# Altium schematic sheet Top_Level.SchDoc
size C; SheetNumber: 2; SheetTotal: 5
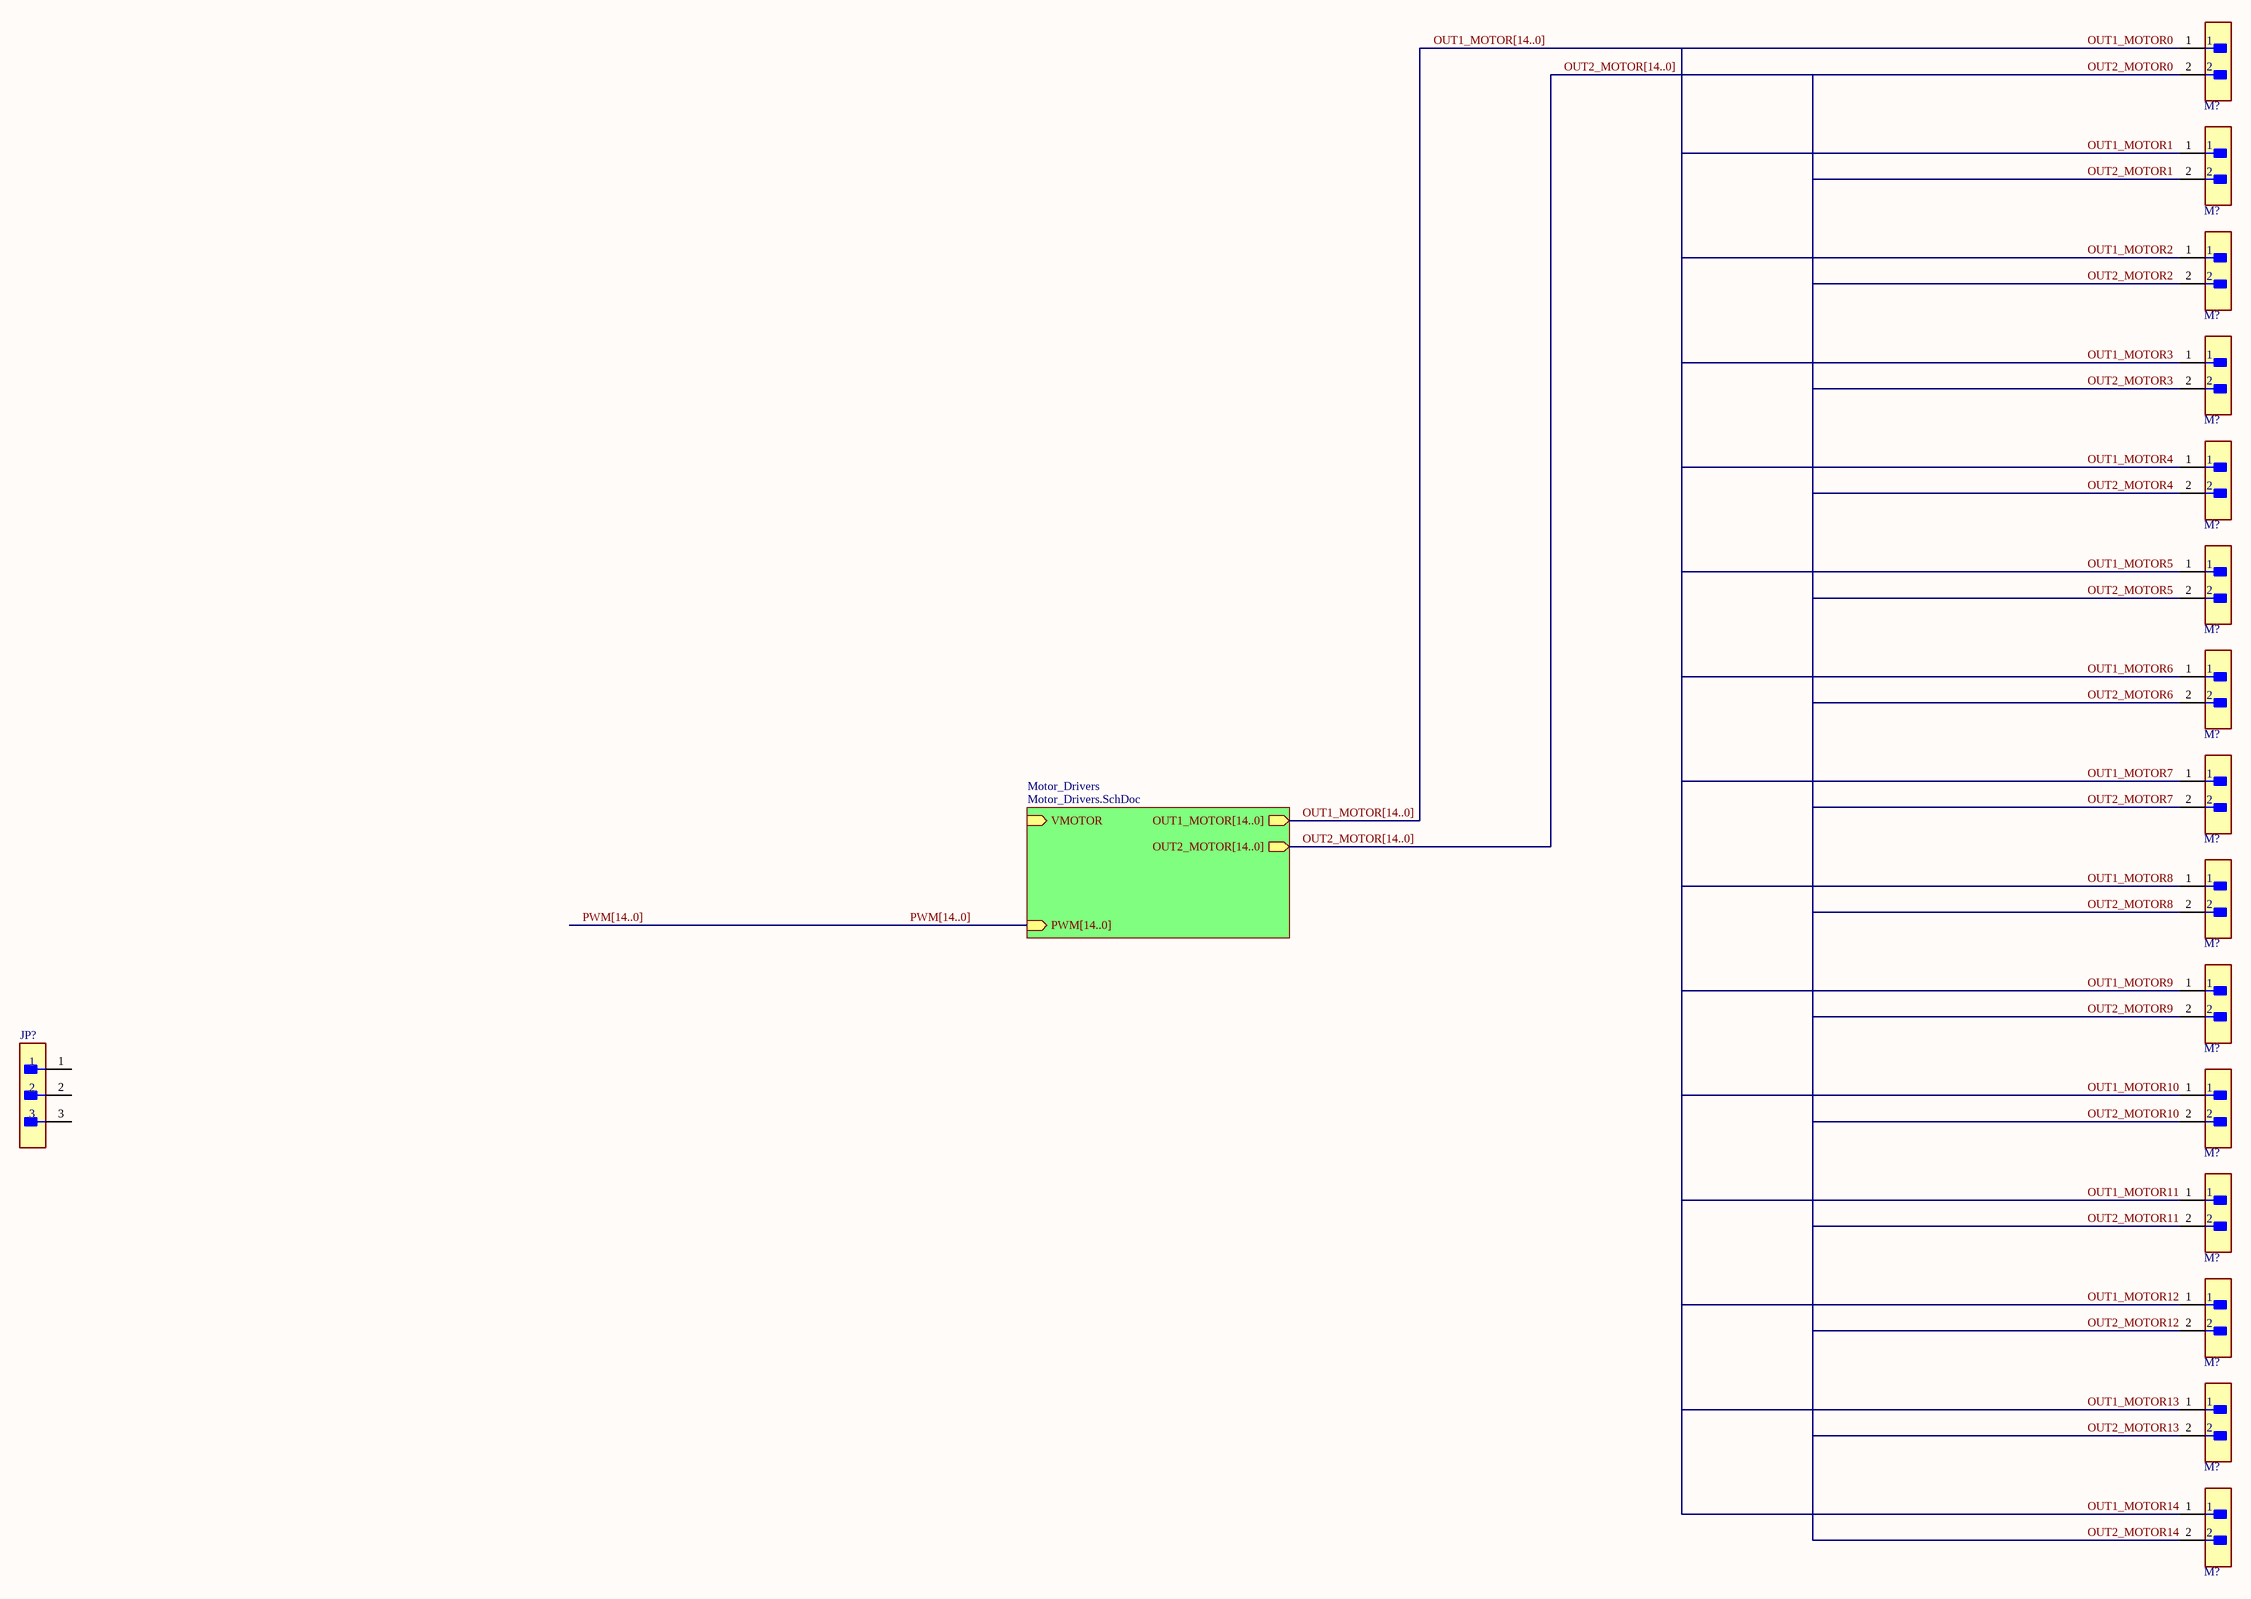
[diagram p0: Top_Level.SchDoc]

## Parts
(Parts that share a designator on the sheet are numbered #1, #2 ... from top to bottom, then left to right.)
JP?  B3B-XH-AM(LF)(SN)  [FP-B3B-XH-AM_LF_SN-MFG]  (value not drawn)
M?#1  B2B-EH-A(LF)(SN)  [FP-B2B-EH-A_LF_SN-MFG]  (value not drawn)
M?#2  B2B-EH-A(LF)(SN)  [FP-B2B-EH-A_LF_SN-MFG]  (value not drawn)
M?#3  B2B-EH-A(LF)(SN)  [FP-B2B-EH-A_LF_SN-MFG]  (value not drawn)
M?#4  B2B-EH-A(LF)(SN)  [FP-B2B-EH-A_LF_SN-MFG]  (value not drawn)
M?#5  B2B-EH-A(LF)(SN)  [FP-B2B-EH-A_LF_SN-MFG]  (value not drawn)
M?#6  B2B-EH-A(LF)(SN)  [FP-B2B-EH-A_LF_SN-MFG]  (value not drawn)
M?#7  B2B-EH-A(LF)(SN)  [FP-B2B-EH-A_LF_SN-MFG]  (value not drawn)
M?#8  B2B-EH-A(LF)(SN)  [FP-B2B-EH-A_LF_SN-MFG]  (value not drawn)
M?#9  B2B-EH-A(LF)(SN)  [FP-B2B-EH-A_LF_SN-MFG]  (value not drawn)
M?#10  B2B-EH-A(LF)(SN)  [FP-B2B-EH-A_LF_SN-MFG]  (value not drawn)
M?#11  B2B-EH-A(LF)(SN)  [FP-B2B-EH-A_LF_SN-MFG]  (value not drawn)
M?#12  B2B-EH-A(LF)(SN)  [FP-B2B-EH-A_LF_SN-MFG]  (value not drawn)
M?#13  B2B-EH-A(LF)(SN)  [FP-B2B-EH-A_LF_SN-MFG]  (value not drawn)
M?#14  B2B-EH-A(LF)(SN)  [FP-B2B-EH-A_LF_SN-MFG]  (value not drawn)
M?#15  B2B-EH-A(LF)(SN)  [FP-B2B-EH-A_LF_SN-MFG]  (value not drawn)

## Sub-sheets
Motor_Drivers = Motor_Drivers.SchDoc: VMOTOR (in), PWM[14..0] (in), OUT1_MOTOR[14..0] (out), OUT2_MOTOR[14..0] (out)

## Nets
OUT1_MOTOR0: M?#1.1
OUT1_MOTOR1: M?#2.1
OUT1_MOTOR2: M?#3.1
OUT1_MOTOR3: M?#4.1
OUT1_MOTOR4: M?#5.1
OUT1_MOTOR5: M?#6.1
OUT1_MOTOR6: M?#7.1
OUT1_MOTOR7: M?#8.1
OUT1_MOTOR8: M?#9.1
OUT1_MOTOR9: M?#10.1
OUT1_MOTOR10: M?#11.1
OUT1_MOTOR11: M?#12.1
OUT1_MOTOR12: M?#13.1
OUT1_MOTOR13: M?#14.1
OUT1_MOTOR14: M?#15.1
OUT2_MOTOR0: M?#1.2
OUT2_MOTOR1: M?#2.2
OUT2_MOTOR2: M?#3.2
OUT2_MOTOR3: M?#4.2
OUT2_MOTOR4: M?#5.2
OUT2_MOTOR5: M?#6.2
OUT2_MOTOR6: M?#7.2
OUT2_MOTOR7: M?#8.2
OUT2_MOTOR8: M?#9.2
OUT2_MOTOR9: M?#10.2
OUT2_MOTOR10: M?#11.2
OUT2_MOTOR11: M?#12.2
OUT2_MOTOR12: M?#13.2
OUT2_MOTOR13: M?#14.2
OUT2_MOTOR14: M?#15.2

Not connected (* = marked no-connect by the designer): JP? 1 2 3

## Buses and harness runs
bus OUT1_MOTOR[14..0] = sheet Motor_Drivers/OUT1_MOTOR[14..0]
bus OUT2_MOTOR[14..0] = sheet Motor_Drivers/OUT2_MOTOR[14..0]
bus PWM[14..0] = sheet Motor_Drivers/PWM[14..0]

## Library data of the parts
JP? = CMP-17438-000009-1: CONN HEADER VERT 3POS 2.5MM; Max Current Rating: 3A; Gender: Male; Max Voltage Rating (AC): 250V; Connector Type: Male Pin; Pitch: 0.098inch; Number of Positions: 3; Contact Resistance: 20mR; Termination: Press-Fit; Housing Color: White; Housing Material: Polyamide; Orientation: Straight; Contact Material: Brass; Contact Type: Male Pin; Color: Natural; Packaging: Bulk; Lead Free: Lead Free; Depth: 5.75mm; Number of Rows: 1; Contact Plating: Tin; Length: 9.9mm; Max Operating Temperature: 85°C; Series: XH; Min Operating Temperature: -25°C; Fastening Type: Detent; Mount: Through Hole
M?#1-M?#15 = CMP-17439-000026-1: CONN HEADER VERT 2POS 2.5MM; Number of Contacts: 2; Current Rating: 3A; Connector Type: Plug; Contact Resistance: 20mR; Gender: Male; Voltage Rating: 250V; Fastening Type: Detent; Depth: 3.8mm; Max Operating Temperature: 85°C; Orientation: Straight; Series: EH; Contact Plating: Tin; Min Operating Temperature: -25°C; Contact Type: Male Pin; Housing Color: White; Termination: Press-Fit; Housing Material: Nylon; Pitch: 2.5mm; Number of Positions: 2; Max Current Rating: 3A; Packaging: Bulk; Lead Free: Lead Free; Number of Rows: 1; Length: 7.5mm; Contact Mating Length: 0.13inch; Color: Natural; Max Voltage Rating (AC): 250V; Contact Material: Copper Alloy; Mount: Through Hole